# Altium schematic sheet ESP32.SchDoc
size A4
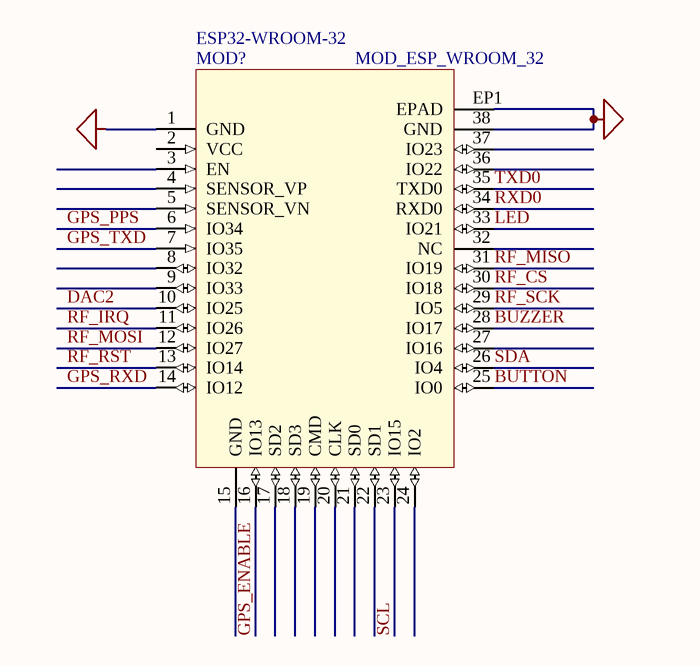
[diagram p0: ESP32.SchDoc]

## Parts
MOD?  value ESP32-WROOM-32  [MOD_ESP_WROOM_32]  (hidden comment: 2.4 GHz Wi-Fi-and-Bluetooth combo chip)

## Nets
GND: MOD?.1(GND) MOD?.38(GND) MOD?.EP1(EPAD)
BUTTON: MOD?.25(IO0)
BUZZER: MOD?.28(IO17)
DAC2: MOD?.10(IO25)
GPS_ENABLE: MOD?.16(IO13)
GPS_PPS: MOD?.6(IO34)
GPS_RXD: MOD?.14(IO12)
GPS_TXD: MOD?.7(IO35)
LED: MOD?.33(IO21)
RF_CS: MOD?.30(IO18)
RF_IRQ: MOD?.11(IO26)
RF_MISO: MOD?.31(IO19)
RF_MOSI: MOD?.12(IO27)
RF_RST: MOD?.13(IO14)
RF_SCK: MOD?.29(IO5)
RXD0: MOD?.34(RXD0)
SCL: MOD?.23(IO15)
SDA: MOD?.26(IO4)
TXD0: MOD?.35(TXD0)

Not connected (* = marked no-connect by the designer): MOD? 2(VCC) 3(EN) 4(SENSOR_VP) 5(SENSOR_VN) 8(IO32) 9(IO33) 15(GND) 17(SD2) 18(SD3) 19(CMD) 20(CLK) 21(SD0) 22(SD1) 24(IO2) 27(IO16) 32(NC) 36(IO22) 37(IO23)

## Library data of the parts
MOD? = MOD_ESP32-WROOM-32: Manufacturer: ESPRESSIF; SCH_Footprint: MOD_ESP_WROOM_32; Part Number: MOD_ESP32-WROOM-32; HelpURL: https://www.espressif.com/sites/default/files/documentation/esp32_datasheet_en.pdf; Manufacturer Part Number: ESP32-WROOM-32; Supplier 1: TME; Supplier Part Number 1: ESP32-WROOM-32; Supplier 2: RS Components; Supplier Part Number 2: 169-7594; Supplier 3: Farnell; Supplier 4: Mouser; Supplier Part Number 4: 356-ESP-WROOM-32; Supplier 5: Digi-Key; Supplier Part Number 5: 1904-1010-1-ND